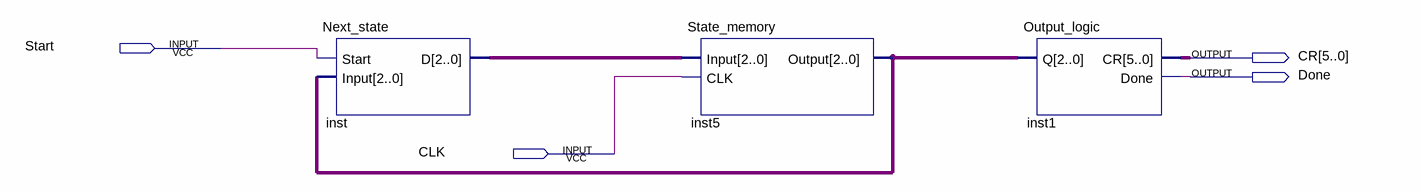
[diagram p0: schematic sheet]
// Quartus schematic Controller_version1.bdf as structural Verilog: 3 symbols, 4 pins
module Controller_version1 (
  input  Start,
  input  CLK,
  output [5:0] CR,
  output Done
);

  wire [2:0] inst5_output, inst_d;

  Next_state inst (.Start(Start), .Input(inst5_output), .D(inst_d));
  State_memory inst5 (.Input(inst_d), .CLK(CLK), .Output(inst5_output));
  Output_logic inst1 (.Q(inst5_output), .CR(CR), .Done(Done));
endmodule
